# EAGLE design ir-sensor-breakout-mk-1.0 (EAGLE 6.5.0)
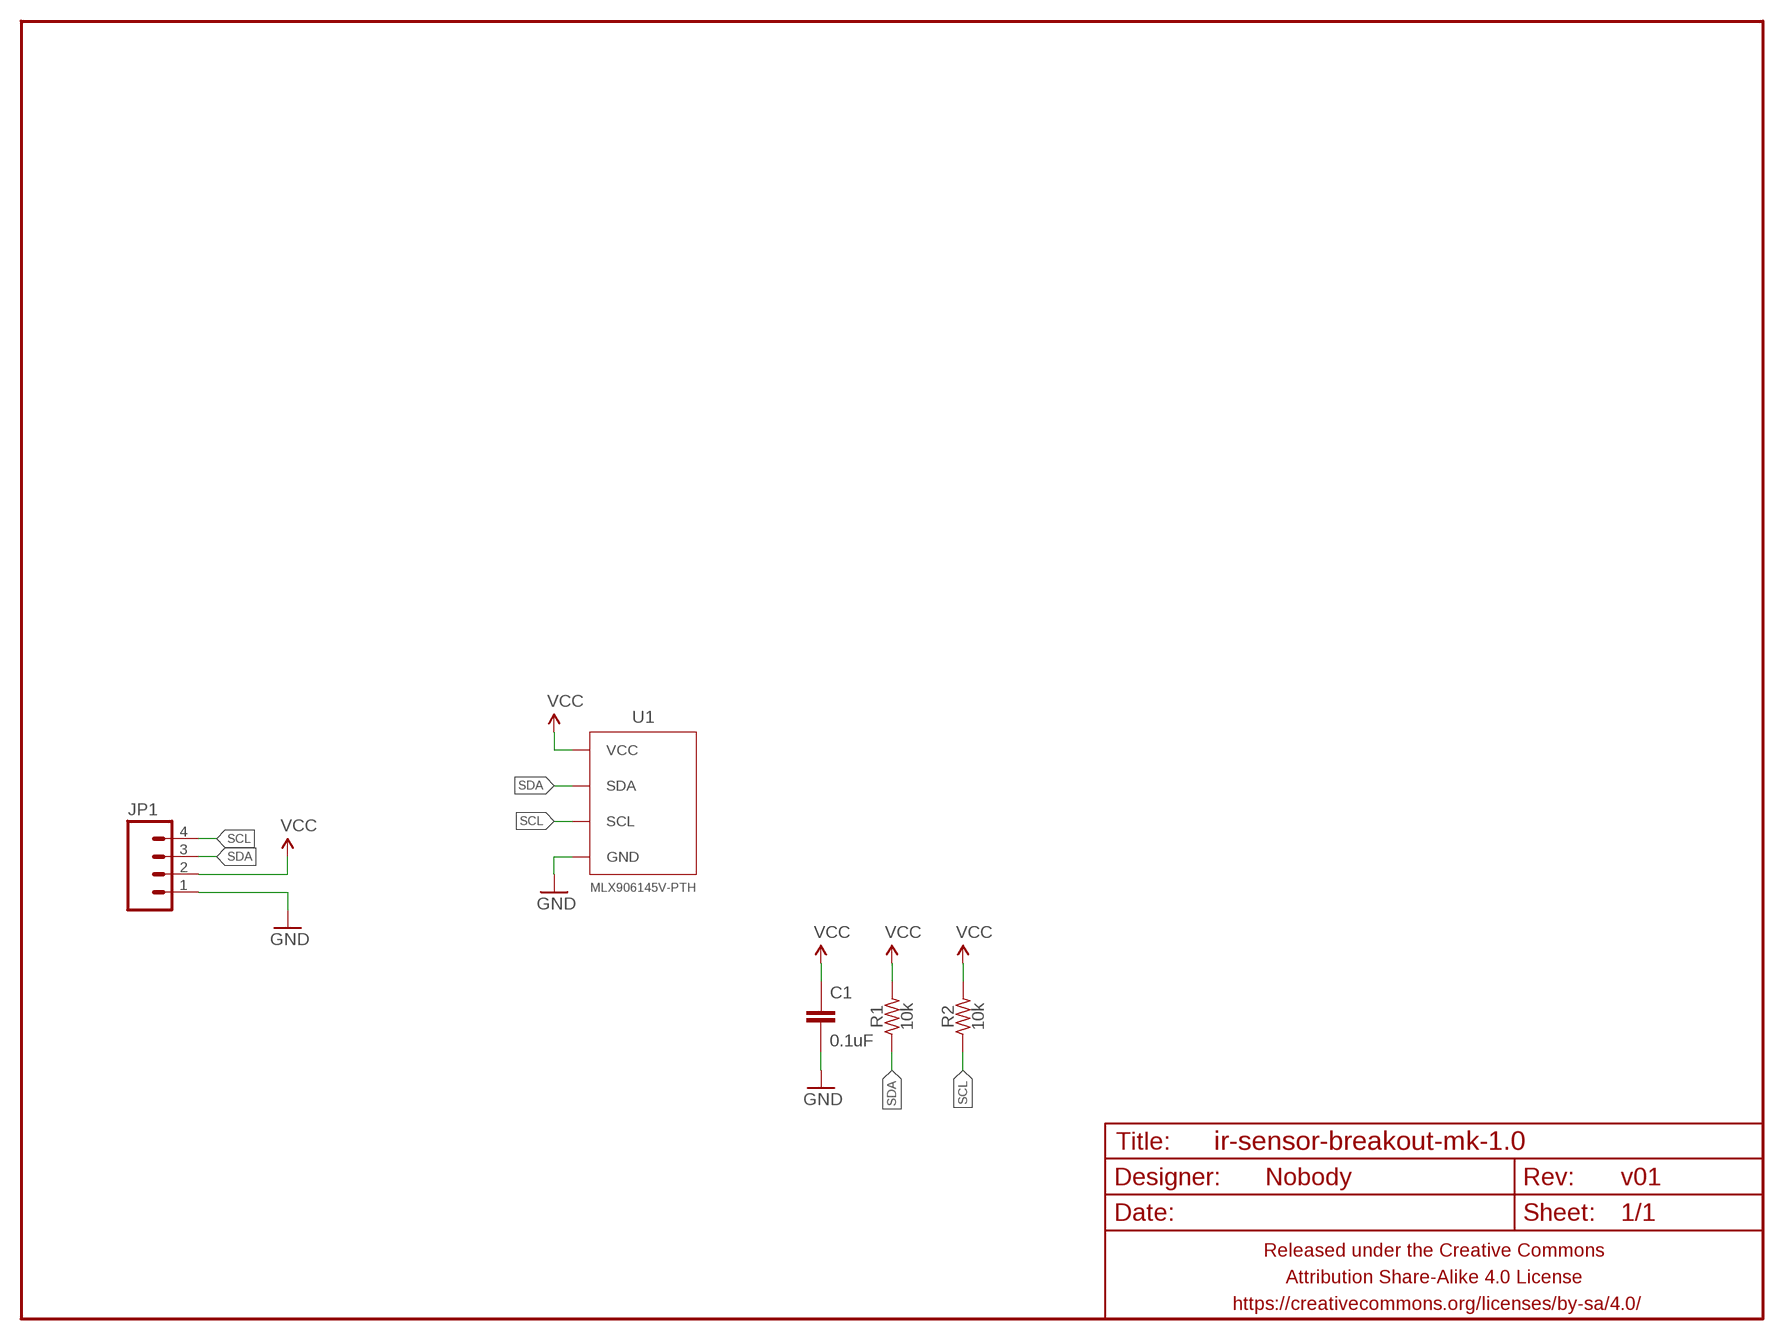
[diagram p0: schematic, sheet 1]

## Parts
C1  0.1uF  CAPACITOR-CERAMIC025-024X044  [C025-024X044]
FRAME1  FRAME-LETTERNO_PACKAGE  [DUMMY]
JP1  M04JST-PTH  [JST-4-PH-RA-PTH]
R1  10k  RESISTORPTH-AXIAL-7.62MM  [RESISTOR-AXIAL-PTH-7.62MM]
R2  10k  RESISTORPTH-AXIAL-7.62MM  [RESISTOR-AXIAL-PTH-7.62MM]
U1  MLX906145V-PTH  [TO-39-4]

## Nets
GND: C1.2 JP1.1 U1.4(GND)
SCL: JP1.4 R2.P$1 U1.1(SCL)
SDA: JP1.3 R1.P$1 U1.2(SDA)
VCC: C1.1 JP1.2 R1.P$2 R2.P$2 U1.3(VCC)

## Library data of the parts
C1 = A_butts:CAPACITOR-CERAMIC: CAPACITOR, European symbol
FRAME1 = A_butts:FRAME-LETTER: Schematic Frame Standard 8.5x11 US Letter frame; DESIGNER: Nobody; VERSION: v01
JP1 = A_butts:M04: Header 4 Standard 4-pin 0.1" header. Use with straight break away headers (SKU : PRT-00116), right angle break away headers (PRT-00553), swiss pins (PRT-00743), machine pins (PRT-00117), and female headers (PRT-00115). Molex polarized connector foot print use with SKU : PRT-08231 with associated crimp pins and housings. 1MM SMD Version SKU: PRT-10208; SKU: PRT-09916
R1 R2 = A_butts:RESISTOR: RESISTOR, American symbol
U1 = A_butts:MLX90614

## Board
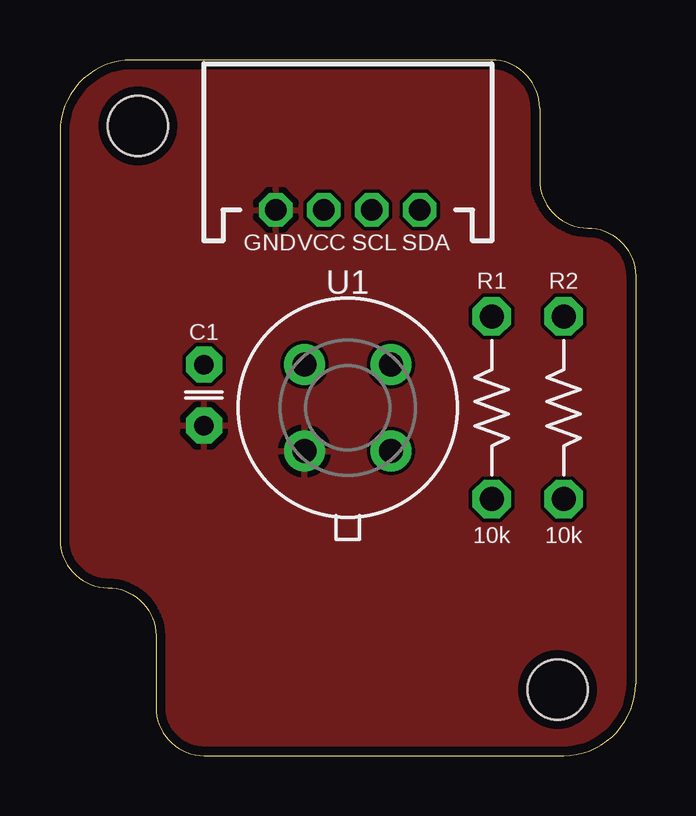
[diagram p1: board, top side]
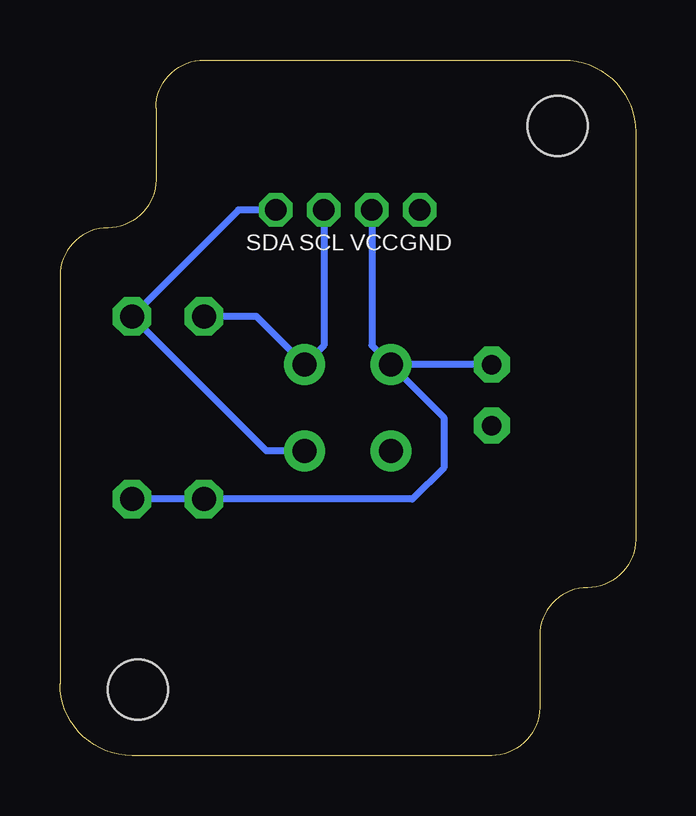
[diagram p2: board, bottom side, seen from below]

Size 24 x 29 mm. Coordinates in mm from the lower left corner, seen from the top.
Outline: 0,26 0,9 arc90 2,7 arc-90 4,5 4,2 arc90 6,0 21,0 arc90 24,3 24,20 arc90 22,22 arc-90 20,24 20,27 arc90 18,29 3,29 arc90 0,26
Copper layers (1*16): Top 0.0356mm / dielectric 1.5011mm / Bottom 0.0356mm
Design rules "LaenPCBOrder_2": minimum track width 6mil, minimum drill 13mil, track to track 6mil, track to pad 6mil, pad to pad 6mil, via to via 6mil, smd to smd 6mil, copper to edge 15mil, drill to drill 6mil, minimum pad ring 7mil, minimum via ring 7mil, stop-mask expansion 3mil, vias tented up to drill 20mil, thermal gap 10mil
Holes 2.5 mm at 20.75,2.75 3.25,26.25

### Footprints (pad centres in the part's own frame; a part is rotated, then mirrored left to right if it is on the bottom)
C025-024X044 = drill 0.813 pad 1.5 octagon: 1 -1.27,0; 2 1.27,0
JST-4-PH-RA-PTH = drill 0.9 pad 1.4 octagon: 1 0,0; 2 2,0; 3 4,0; 4 6,0
RESISTOR-AXIAL-PTH-7.62MM = drill 1 pad 1.6 octagon: P$1 -3.81,0; P$2 3.81,0
TO-39-4 = drill 1 pad 1.7: 1 -1.8,1.8; 2 -1.8,-1.8; 3 1.8,-1.8; 4 1.8,1.8

### Placement (x,y rotation side)
C1  6,15.03 270 top
FRAME1  0,0 0 top
JP1  9,22.75 0 top
R1  18,14.5 270 top
R2  21,14.5 270 top
U1  12,14.5 180 top

### Tracks (layer width: path | path; a pad name or v marks a point on that pad's centre or on a via)
GND
  pour Top: -0.1,-0.1 24.1,-0.1 24.1,29.1 -0.1,29.1
SCL
  Bottom 0.3: JP1.4 16.56,22.75 R2.P$1 15.39,12.7 U1.1
SDA
  Bottom 0.3: JP1.3 13,17.1 U1.2 15.81,18.31 R1.P$1
VCC
  Bottom 0.3: JP1.2 11,17.1 U1.3 | C1.1 U1.3 | U1.3 8,14.1 8,12 9.31,10.69 R1.P$2 R2.P$2

### Text on the board
tPlace: GND | VCC | SCL | SDA
bPlace: GND | VCC | SCL | SDA